# EasyEDA Pro project RGB_light_master.epro

# Schematic Schematic1
Board Name: Board1; Create Date: 2025-02-03
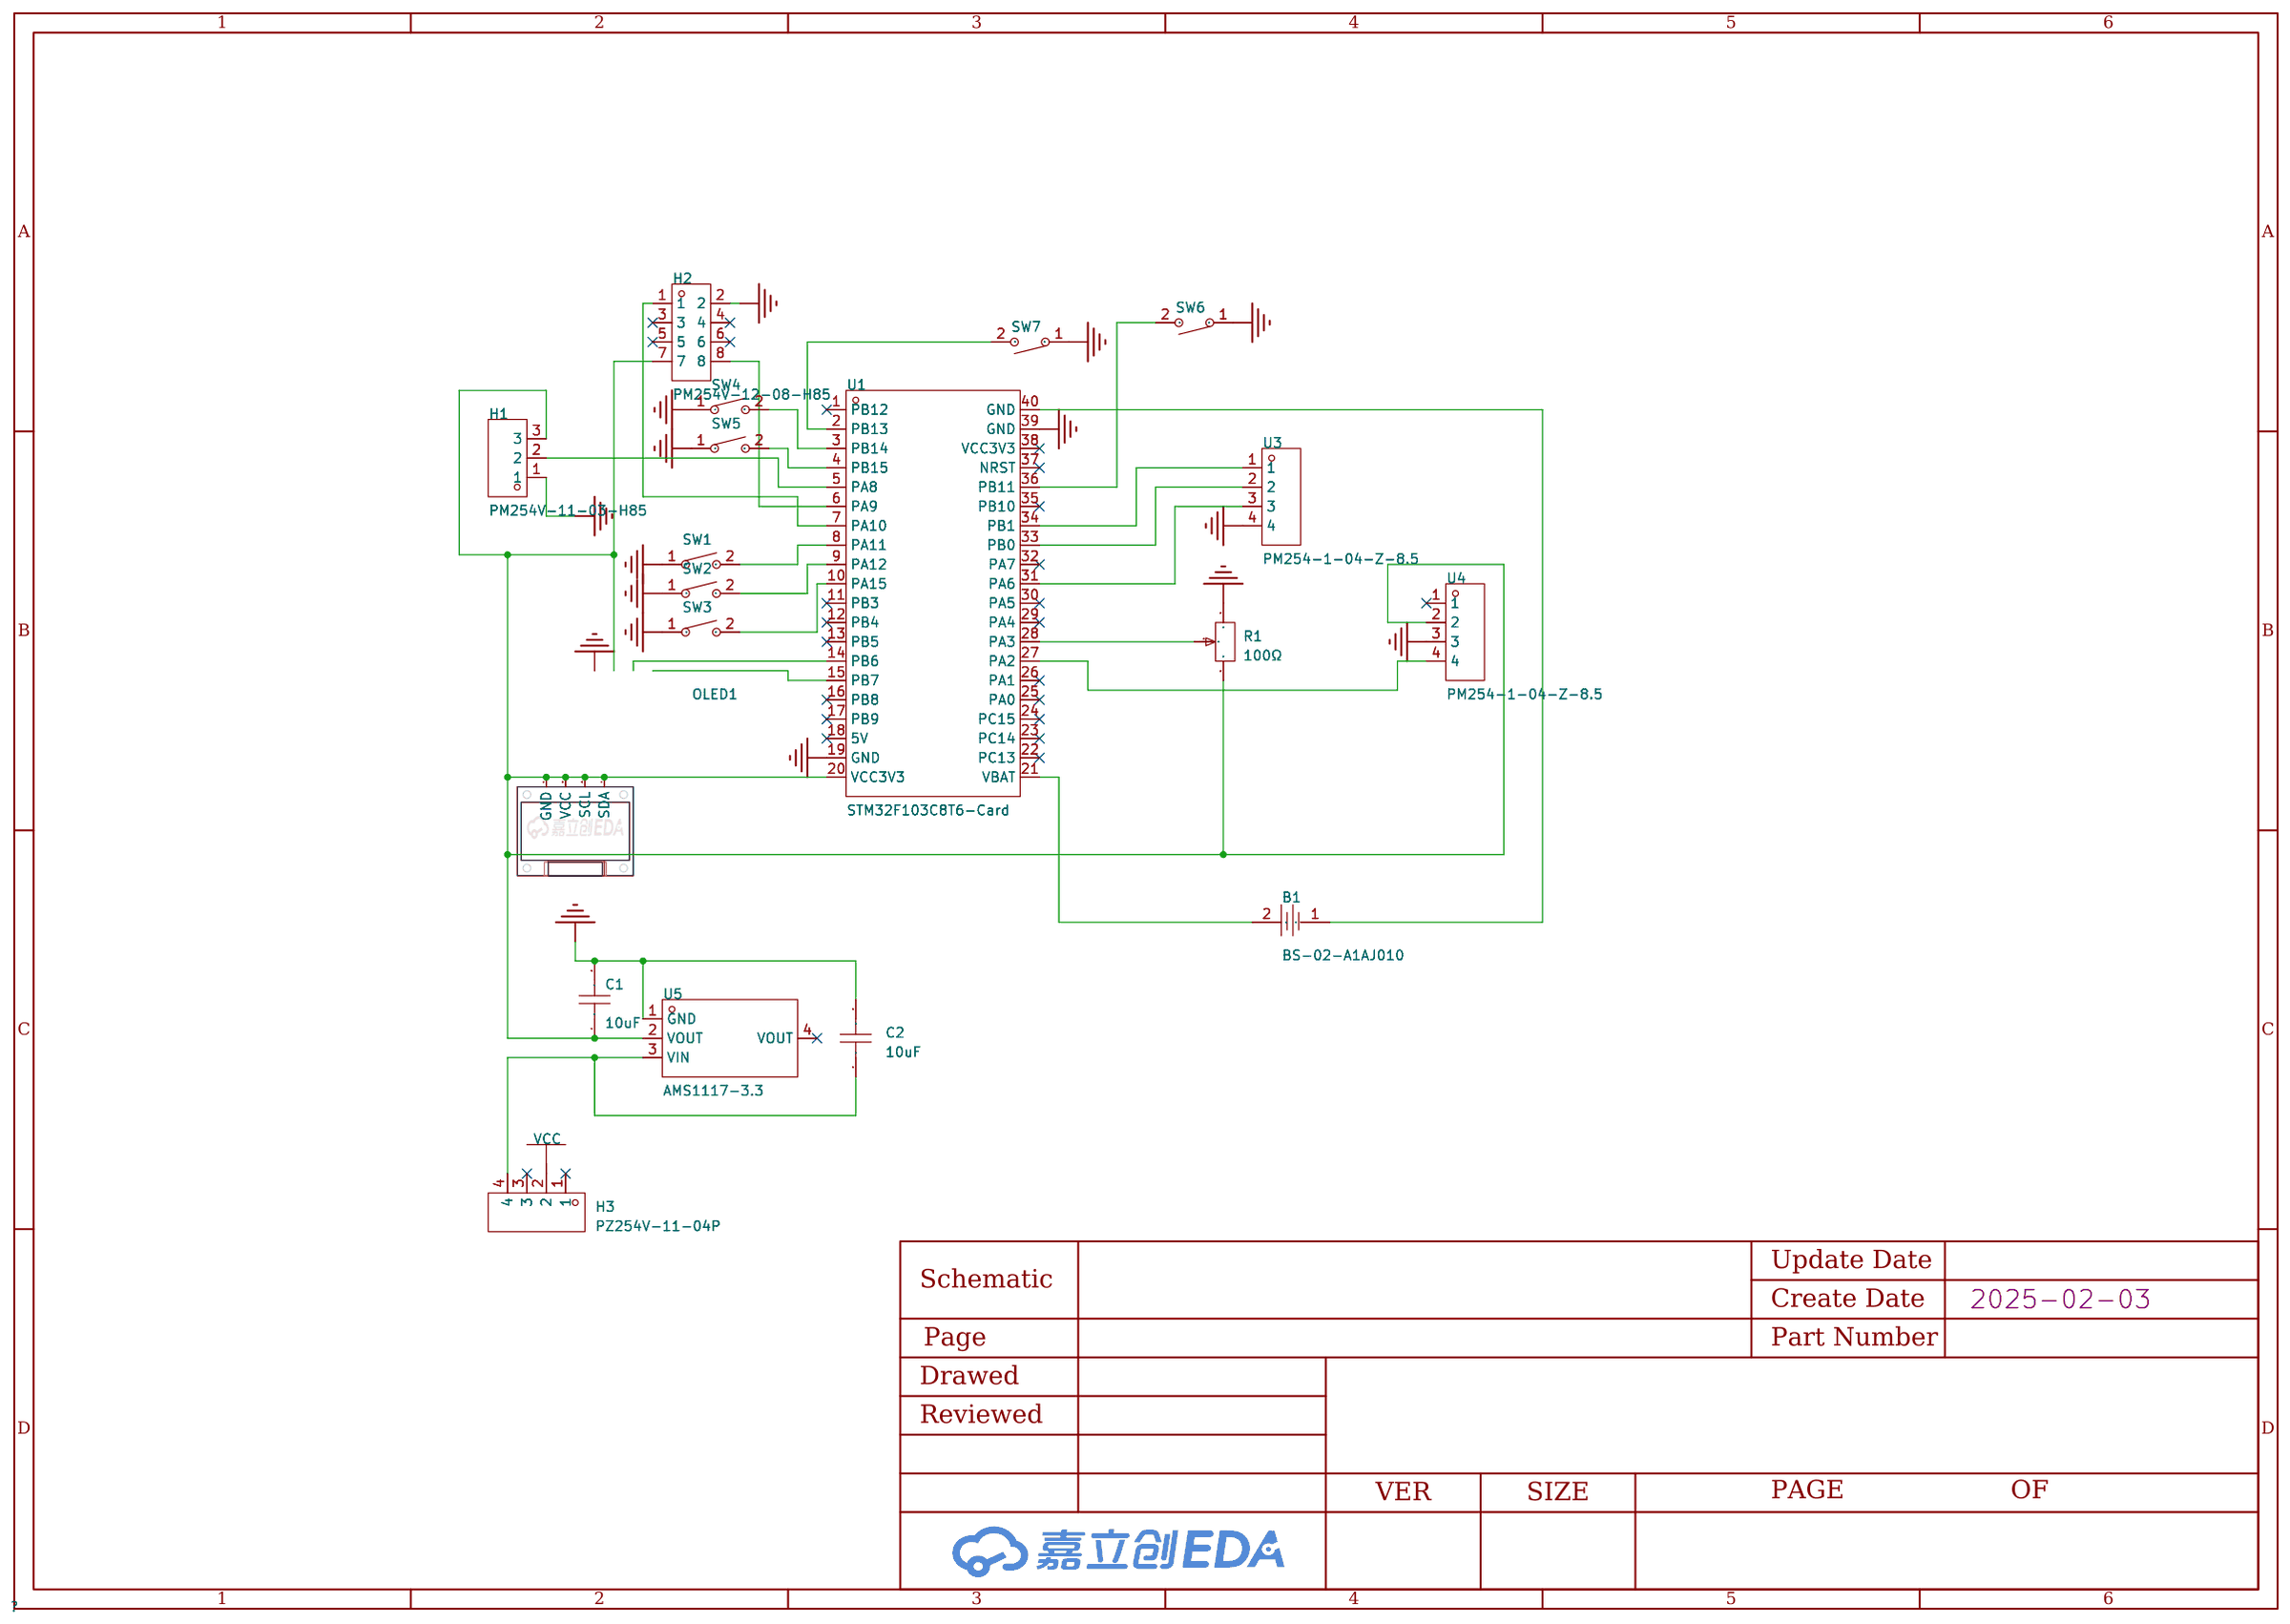
[diagram p0: schematic sheet]

## Parts
B1  BS-02-A1AJ010  [BAT-TH_BS-02-A1AJ010]
C1  10uF  [C0805]
C2  10uF  [C0805]
H1  PM254V-11-03-H85  [HDR-TH_3P-P2.54-V-F]
H2  PM254V-12-08-H85  [HDR-TH_8P-P2.54-V-F-R2-C4-S2.54]
H3  PZ254V-11-04P  [HDR-TH_4P-P2.54-V-M]
OLED1  -  [0.96OLED_4P]
R1  100Ω  [RES-ADJ-TH_3296W]
SW1  TC-1101T-C-B-B  [KEY-TH_2P-L6.0-W3.5-P6.50]
SW2  TC-1101T-C-B-B  [KEY-TH_2P-L6.0-W3.5-P6.50]
SW3  TC-1101T-C-B-B  [KEY-TH_2P-L6.0-W3.5-P6.50]
SW4  TC-1101T-C-B-B  [KEY-TH_2P-L6.0-W3.5-P6.50]
SW5  TC-1101T-C-B-B  [KEY-TH_2P-L6.0-W3.5-P6.50]
SW6  TC-1101T-C-B-B  [KEY-TH_2P-L6.0-W3.5-P6.50]
SW7  TC-1101T-C-B-B  [KEY-TH_2P-L6.0-W3.5-P6.50]
U1  STM32F103C8T6-Card  [CONN-TH_L53.3-W22.9_STM32F103C8T6-CARD]
U3  PM254-1-04-Z-8.5  [hdr-th_4p-p2.54-v-f]
U4  PM254-1-04-Z-8.5  [hdr-th_4p-p2.54-v-f]
U5  AMS1117-3.3  [SOT-223-3_L6.5-W3.4-P2.30-LS7.0-BR]

## Library data of the parts
B1 = BS-02-A1AJ010: 连接器类型:电池底座;适用电池规格:CR2032;触头材质:磷青铜;触点电镀:镍;工作温度范围:-25℃~+85℃;; LCSC Part Name: 电池底座 适用电池:CR2032; Supplier Part: C5239862; Manufacturer: MYOUNG(美阳); Supplier Footprint: 插件; JLCPCB Part Class: 扩展库; Datasheet: https://atta.szlcsc.com/upload/public/pdf/source/20221102/8F00F2B23A2A3C447A59C327BBA6C743.pdf; Supplier: LCSC; Connector Type: 电池底座; Battery Type: CR2032; Contact Material: 磷青铜; Contact Plating: 镍; Operating Temperature Range: -25℃~+85℃
C1 C2 = TMK212BBJ106KGHT: 容值:10uF;精度:±10%;额定电压:25V;材质(温度系数):X5R;; LCSC Part Name: 10uF ±10% 25V; Supplier Part: C386084; Manufacturer: TAIYO YUDEN(太诱); Supplier Footprint: 0805; JLCPCB Part Class: Extended Part; Datasheet: https://atta.szlcsc.com/upload/public/pdf/source/20190827/C386084_49734F228C11E6784046689EB1EEAB2A.pdf; Supplier: LCSC; Tolerance: ±10%; Voltage Rated: 25V; Temperature Coefficient: X5R
H1 = PM254V-11-03-H85: 插孔结构:1x3P;间距:2.54mm;行距:-;安装类型:直插;排数:单排;总孔位数:3P;塑高:-;触头材质:黄铜;触头镀层:-;; LCSC Part Name: 间距:2.54mm 1x3P 直插; Supplier Part: C541850; Manufacturer: XFCN(兴飞); Supplier Footprint: 插件,P=2.54mm; JLCPCB Part Class: 扩展库; Datasheet: https://atta.szlcsc.com/upload/public/pdf/source/20200518/C541849_85853D71FC67C51915A806977A588FDA.pdf; Supplier: LCSC; Holes Structure: 1x3P; Pitch: 2.54mm; Mounting Type: 直插; Number of Rows: 单排; Number of Holes: 3P; Contact Material: 黄铜
H2 = PM254V-12-08-H85: 插孔结构:2x4P;间距:2.54mm;行距:2.54mm;圆孔/方孔:方孔;安装类型:直插;排数:双排;总孔位数:8P;额定电流:3A;额定电压:250V;插孔方向:顶部;塑高:8.5mm;工作温度范围:-40℃~+105℃;; LCSC Part Name: 间距:2.54mm 2x4P 直插; Supplier Part: C2834799; Manufacturer: XFCN(兴飞); Supplier Footprint: 插件,P=2.54mm; JLCPCB Part Class: 扩展库; Datasheet: https://atta.szlcsc.com/upload/public/pdf/source/20200309/C492399_8C441E2934FBB604A89B37A68AA45ECF.pdf; Supplier: LCSC; Holes Structure: 2x4P; Pitch: 2.54mm; Row Spacing: 2.54mm; Circular Hole / Square Hole: 方孔; Mounting Type: 直插; Number of Rows: 双排; Number of Holes: 8P; Current Rating (Max): 3A; Voltage Rating (Max): 250V; Holes Direction: 顶部; Insulation Height: 8.5mm; Operating Temperature Range: -40℃~+105℃
H3 = PZ254V-11-04P: 插针结构:1x4P;间距:2.54mm;行距:-;圆针/方针:方针;安装类型:直插;排数:单排;总PIN位数:4P;额定电流:3A;额定电压:250V;配合针长度:6mm;塑高:2.5mm;端接针长度:3mm;触头材质:-;工作温度范围:-40℃~+105℃;颜色:黑色;; LCSC Part Name: 间距:2.54mm 1x4P 直插 方针; Supplier Part: C2691448; Manufacturer: XFCN(兴飞); Supplier Footprint: 插件,P=2.54mm; JLCPCB Part Class: 扩展库; Datasheet: https://atta.szlcsc.com/upload/public/pdf/source/20200309/C492403_F9F19131791D08044AD4F84F8E751A34.pdf; Supplier: LCSC; Pin Structure: 1x4P; Pitch: 2.54mm; Circluar Pins/Square Pins: 方针; Mounting Type: 直插; Number of Rows: 单排; Number of Pins: 4P; Current Rating (Max): 3A; Voltage Rating (Max): 250V; Length of Mating Pin: 6mm; Insulation Height: 2.5mm; Length of End Connection Pin: 3mm; Operating Temperature Range: -40℃~+105℃; Color: 黑色
OLED1 = 0.96OLED模块_4P: Supplier Footprint: 插件
R1 = 3296W-1-101LF: 阻值:100Ω;精度:±10%;; LCSC Part Name: 100Ω ±10%; Supplier Part: C83688; Manufacturer: BOURNS; Supplier Footprint: SIP-3P,9.5x4.8mm; JLCPCB Part Class: 扩展库; Datasheet: https://atta.szlcsc.com/upload/public/pdf/source/20180326/C111793_7BE3639881F18EA7BF3D269EDA80A489.pdf; Supplier: LCSC; Tolerance: ±10%
SW1-SW7 = TC-1101T-C-B-B: 电路结构:单刀单掷;按钮形状:矩形按钮;作用力:260gf;安装方式:直插;开关长度:6mm;开关宽度:3.5mm;开关高度:5mm;带支架:不带;触点电流:50mA;额定电压(DC):12V;绝缘电阻:-;带灯:无;机械寿命:5万次;; LCSC Part Name: 6*3.5*5mm 直插 轻触开关; Supplier Part: C500068; Manufacturer: XKB Connectivity(中国星坤); Supplier Footprint: 插件; JLCPCB Part Class: 扩展库; Datasheet: https://atta.szlcsc.com/upload/public/pdf/source/20211011/B69A8CD93B4DADD1FF98516D35420DE2.pdf; Supplier: LCSC; Circuit: 单刀单掷; Actuator Style: 矩形按钮; Operating Force: 260gf; Mounting Style: 直插; Switch Length: 6mm; Switch Width: 3.5mm; Switch Height: 5mm; Strike Gundam: 不带; Contact Current: 50mA; Voltage Rating (DC): 12V; Actuator/Cap Color: 黑色; With Lamp: 无; Pin Style: PC引脚; Mechanical Life: 5万次; Operating Temperature: -20℃~+70℃
U1 = STM32F103C8T6-Card: Supplier Part: C9900077949; Supplier Footprint: 插件; JLCPCB Part Class: Extended Part; Supplier: LCSC
U3 U4 = PM254-1-04-Z-8.5_C2897367: 插孔结构:1x4P;间距:2.54mm;行距:-;圆孔/方孔:方孔;安装类型:直插;排数:单排;总孔位数:4P;额定电流:3A;额定电压:-;插孔方向:顶部;塑高:8.5mm;触头材质:铜合金;工作温度范围:-40℃~+105℃;焊接温度(最大值):260℃@5S;; LCSC Part Name: 1x4P 间距:2.54mm 直插; Supplier Part: C2897367; Manufacturer: HCTL(华灿天禄); Supplier Footprint: 插件,P=2.54mm; JLCPCB Part Class: 扩展库; Datasheet: https://atta.szlcsc.com/upload/public/pdf/source/20230609/534BE42964C679BDE98E061007C4ABD6.pdf; Supplier: LCSC; Holes Structure: 1x4P; Pitch: 2.54mm; Circular Hole / Square Hole: 方孔; Mounting Type: 直插; Number of Rows: 单排; Number of Holes: 4P; Current Rating (Max): 3A; Holes Direction: 顶部; Insulation Height: 8.5mm; Contact Material: 铜合金; Operating Temperature Range: -40℃~+105℃; Soldering Temperature(Max): 260℃@5S
U5 = AMS1117-3.3_C6186: 输出类型:固定;最大输入电压:-;输出电压:3.3V;最大输出电流:1A;电源纹波抑制比(PSRR):72dB@(120Hz);输出极性:正极;; LCSC Part Name: 输出3.3V 1A; Supplier Part: C6186; Manufacturer: AMS; Supplier Footprint: SOT-223; JLCPCB Part Class: 基础库; Datasheet: https://atta.szlcsc.com/upload/public/pdf/source/20180727/C6186_7A095716F0823C02F1997A905E26C086.pdf; Supplier: LCSC; Output Type: 固定; Output Voltage: 3.3V; MAX Output Current: 1A; Power Supply Rejection Ratio (PSRR): 72dB@(120Hz); Dropout Voltage: 1.3V@(800mA); Output Polarity: 正极; Number of Outputs: 1

## Nets
GND: C1.2 C2.2 H1.1 H2.2 R1.1 SW1.1 SW2.1 SW3.1 SW4.1 SW5.1 SW6.1 SW7.1 U1.19(GND) U1.39(GND) U3.4 U4.3 U5.1(GND)
VCC: H3.2
$1N1795: H1.2 U1.5(PA8)
$1N1867: B1.2 U1.21(VBAT)
$1N2447: U1.34(PB1) U3.1
$1N2475: U1.33(PB0) U3.2
$1N2481: U1.31(PA6) U3.3
$1N2668: R1.2 U1.28(PA3)
$1N2708: U1.27(PA2) U4.4
$1N2957: H2.1 U1.7(PA10)
$1N3555: H2.8 U1.6(PA9)
Net-(B1-1): B1.1 U1.40(GND)
Net-(C1-1): C1.1 H1.3 H2.7 OLED1.1(GND) OLED1.2(VCC) OLED1.3(SCL) OLED1.4(SDA) R1.3 U1.20(VCC3V3) U4.2 U5.2(VOUT)
Net-(C2-1): C2.1 H3.4 U5.3(VIN)
Net-(SW1-2): SW1.2 U1.8(PA11)
Net-(SW2-2): SW2.2 U1.9(PA12)
Net-(SW3-2): SW3.2 U1.10(PA15)
Net-(SW4-2): SW4.2 U1.3(PB14)
Net-(SW5-2): SW5.2 U1.4(PB15)
Net-(SW6-2): SW6.2 U1.36(PB11)
Net-(SW7-2): SW7.2 U1.2(PB13)

Not connected (* = marked no-connect by the designer): H2 3* 4* 5* 6*; H3 1* 3*; U1 1(PB12)* 11(PB3)* 12(PB4)* 13(PB5)* 14(PB6) 15(PB7) 16(PB8)* 17(PB9)* 18(5V)* 22(PC13)* 23(PC14)* 24(PC15)* 25(PA0)* 26(PA1)* 29(PA4)* 30(PA5)* 32(PA7)* 35(PB10)* 37(NRST)* 38(VCC3V3)*; U4 1*; U5 4(VOUT)*

# Board PCB1
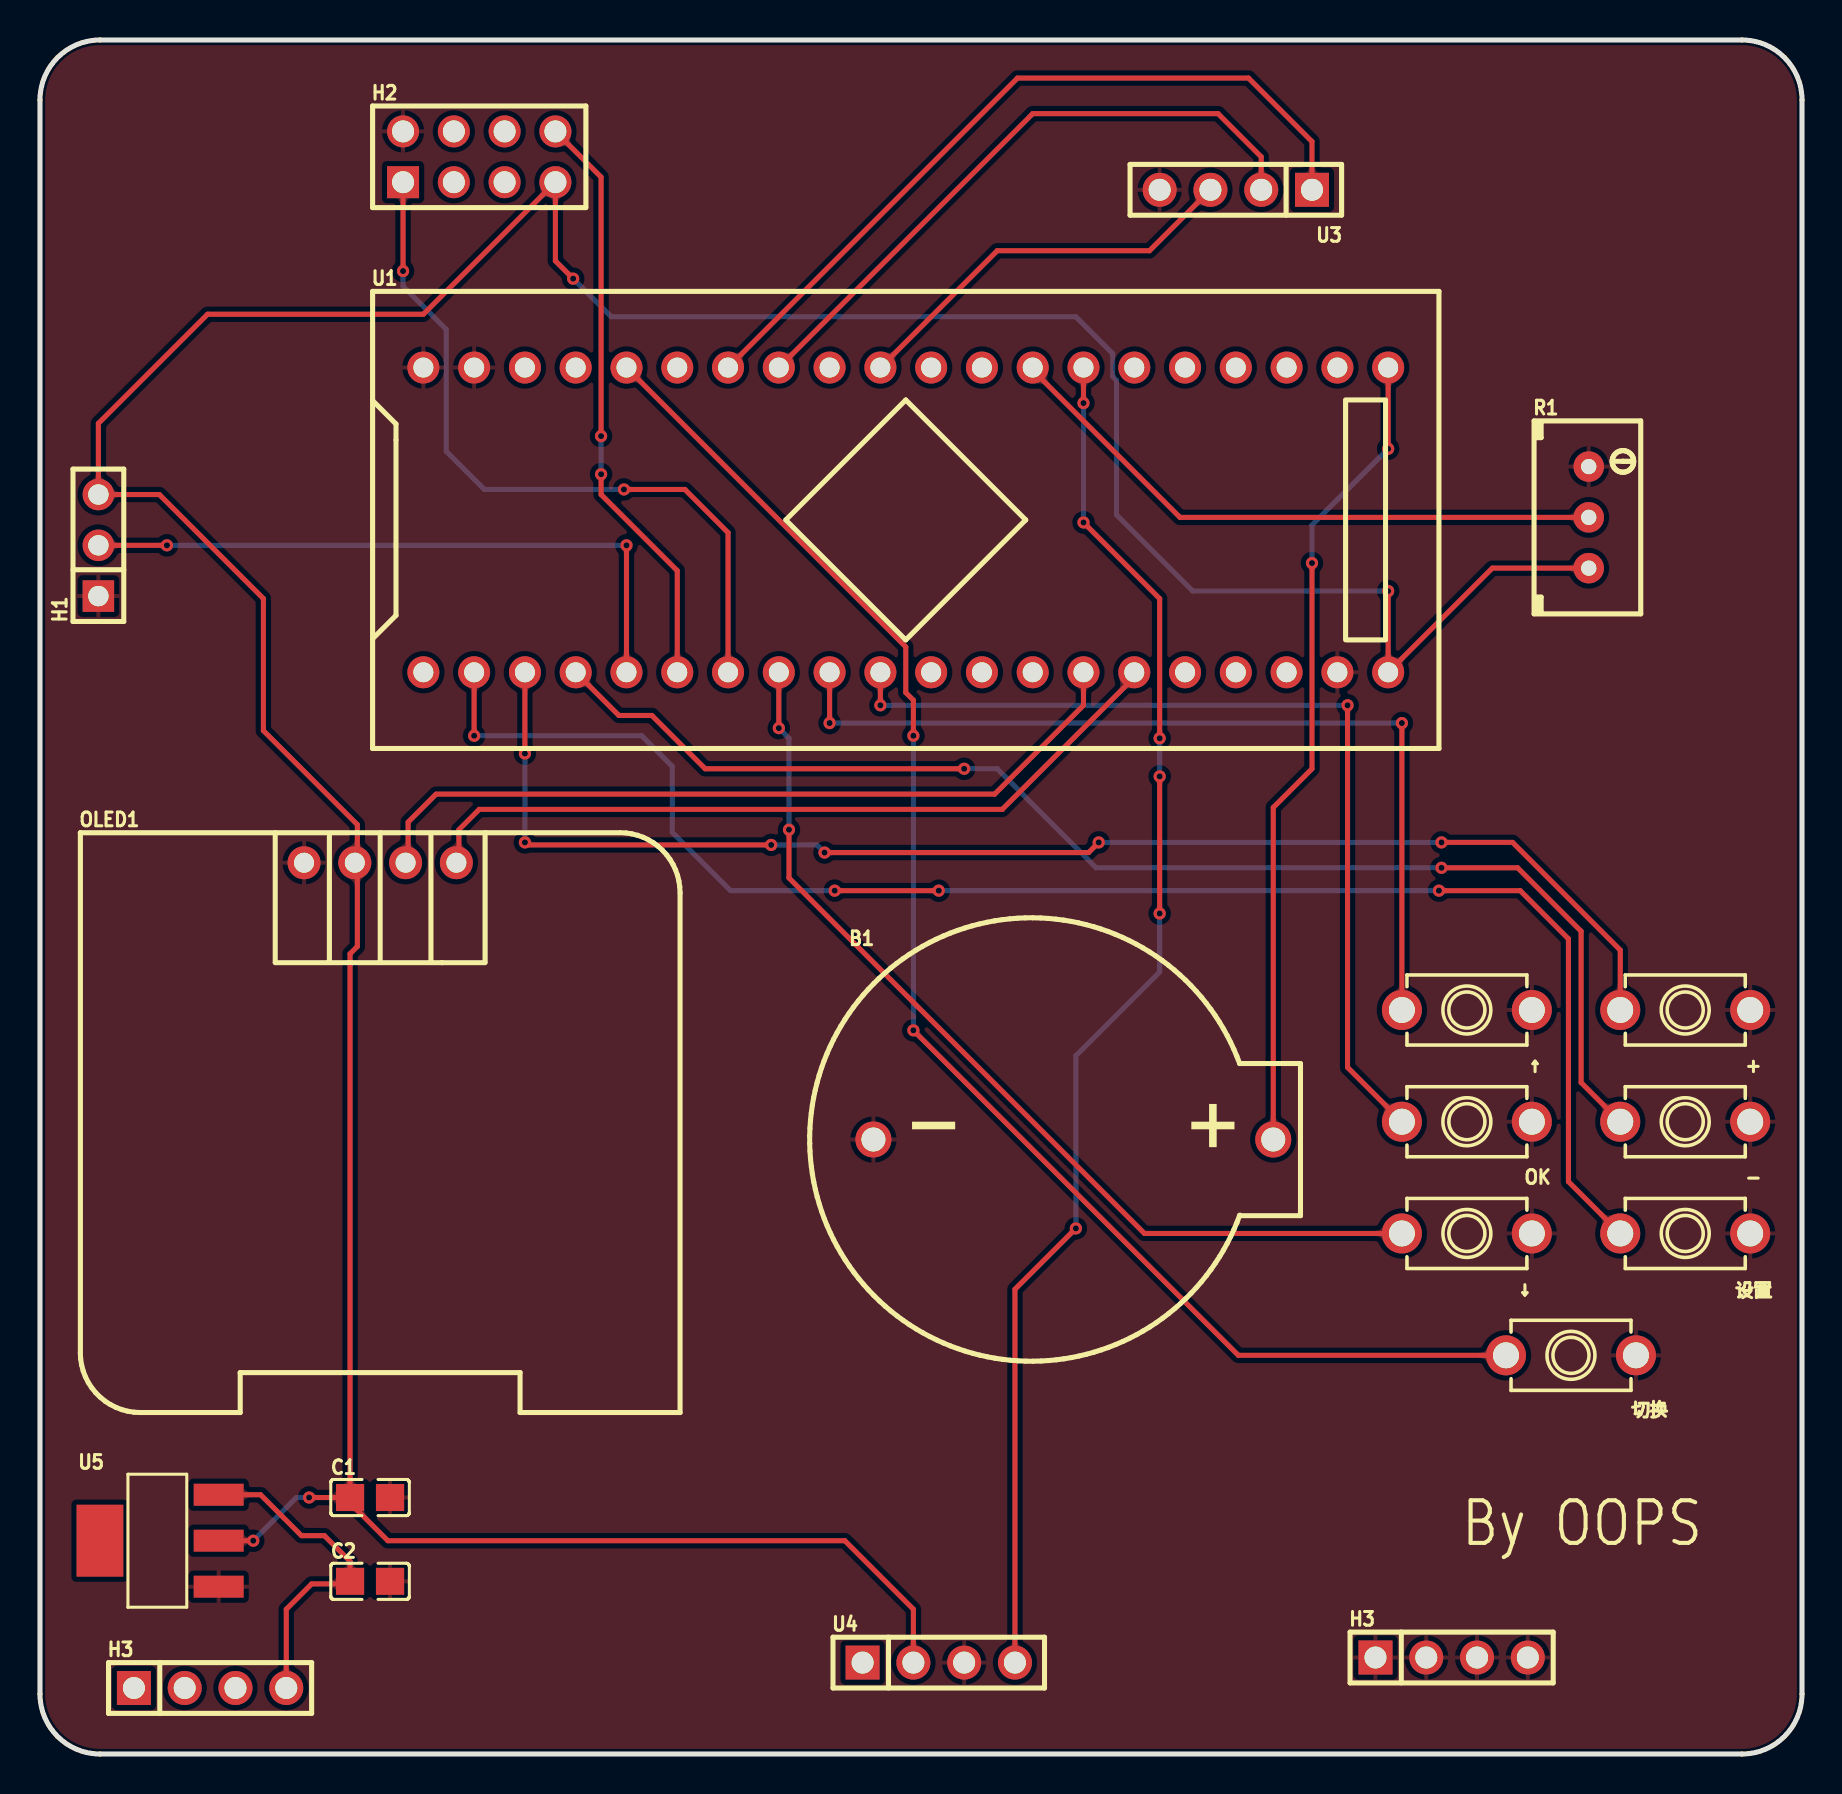
[diagram p1: board, top side]
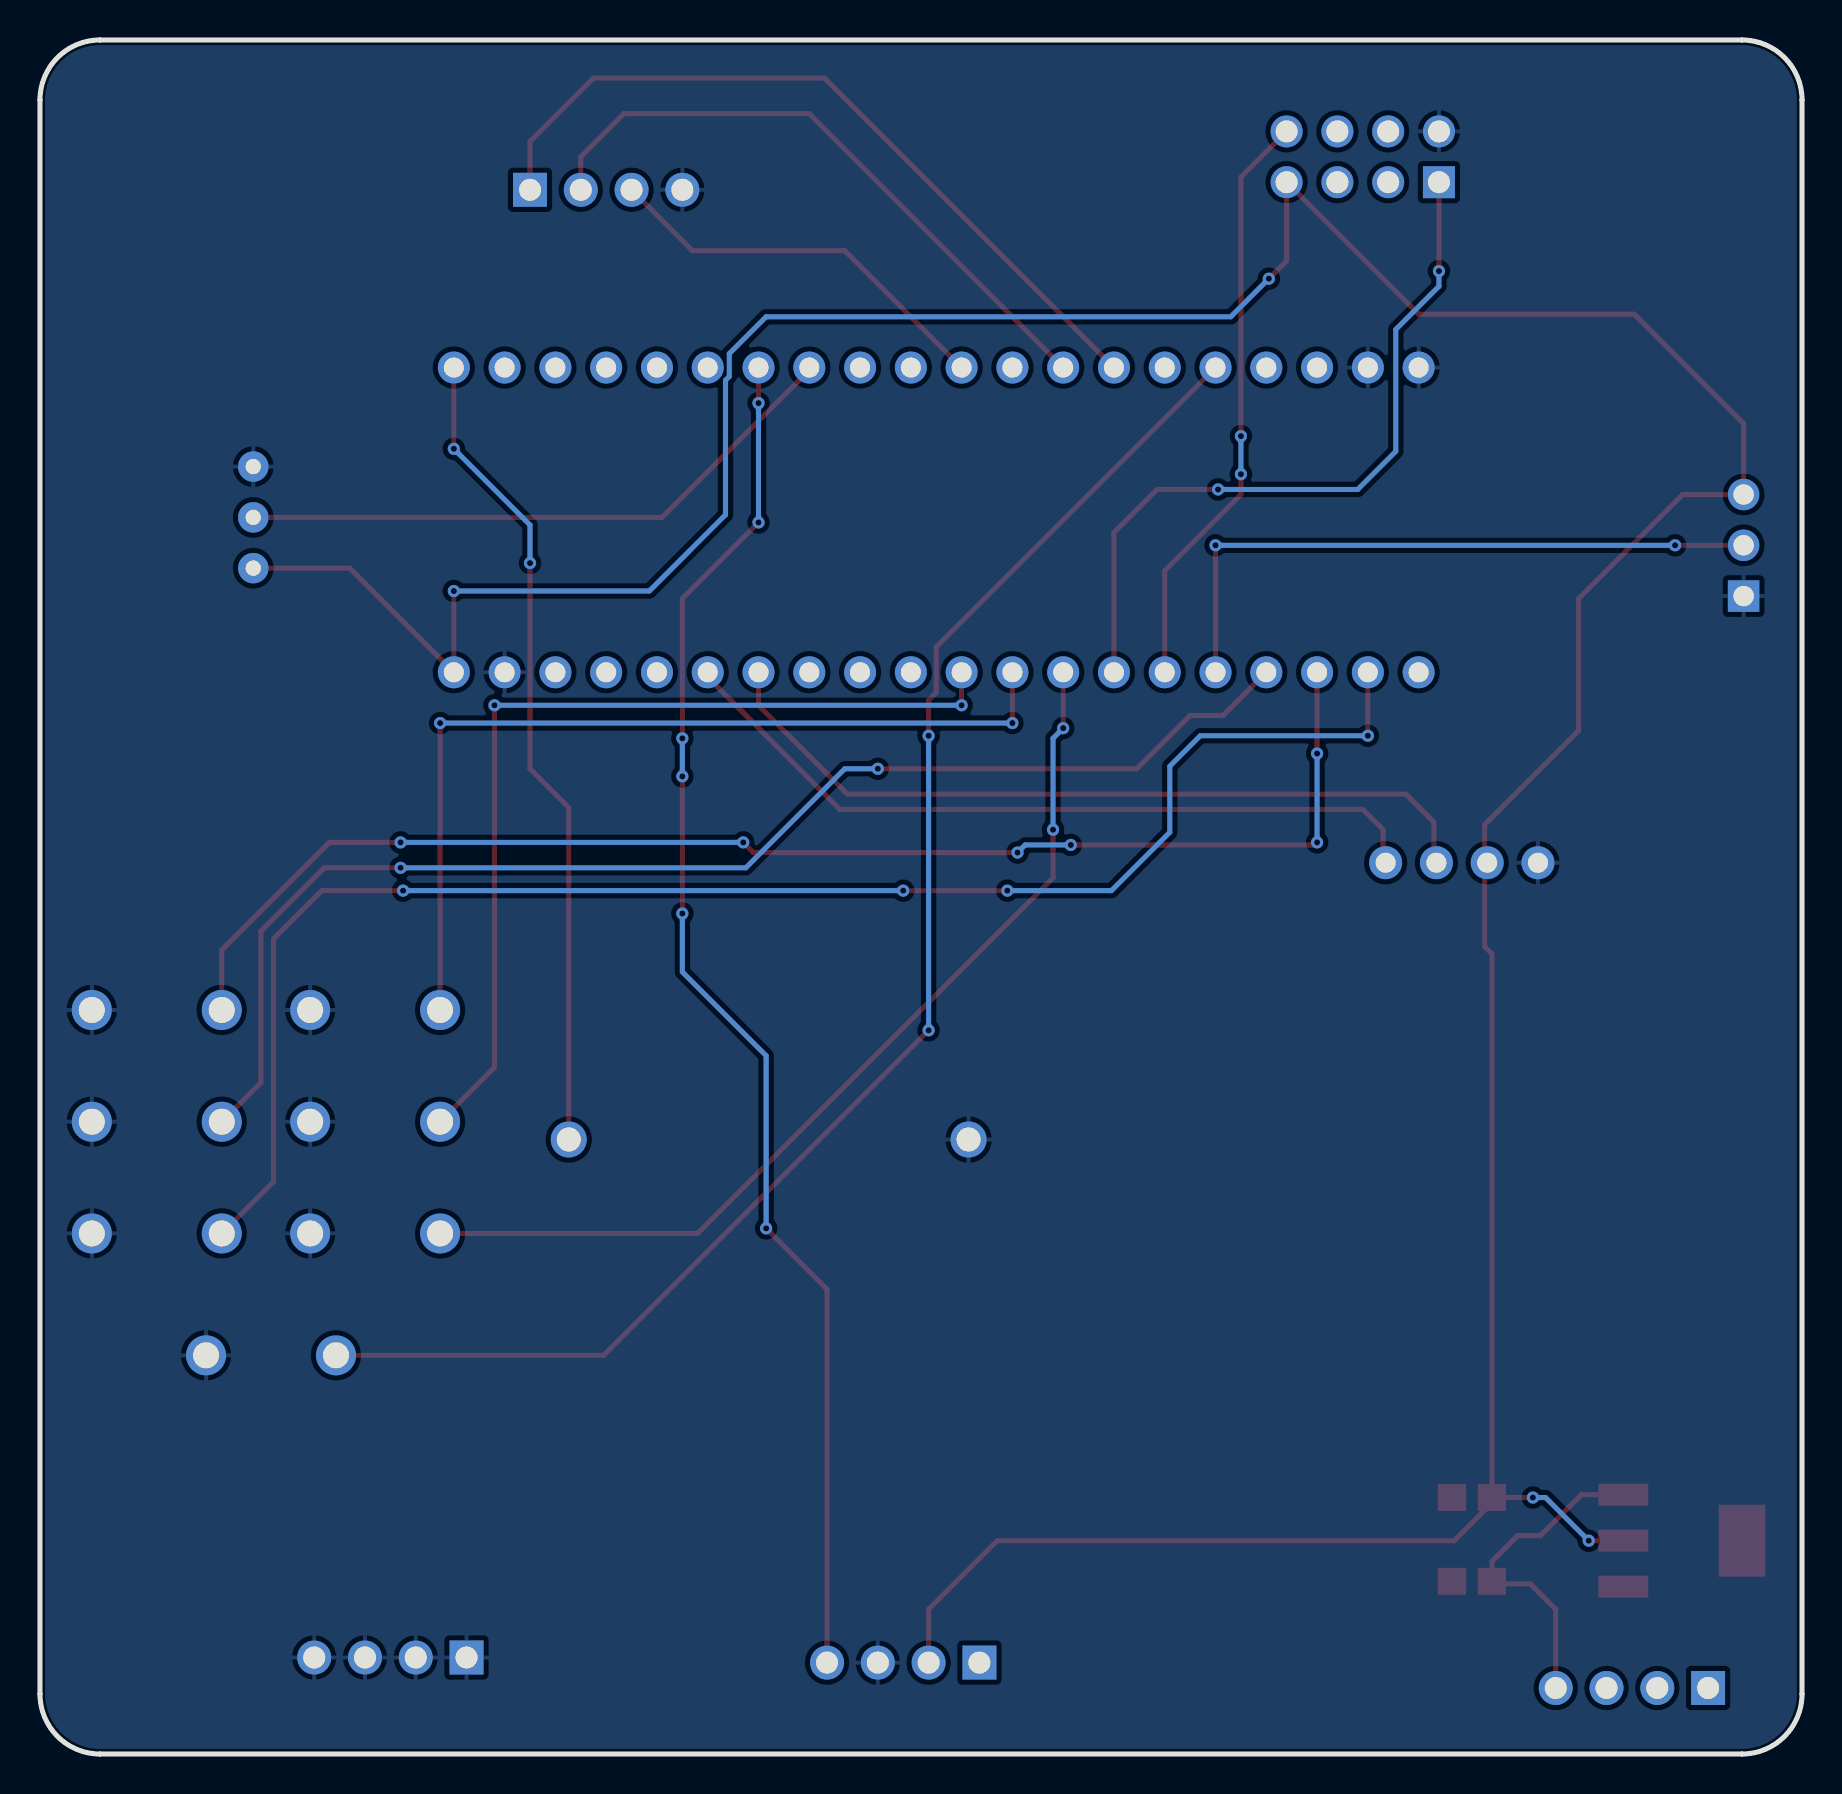
[diagram p2: board, bottom side, seen from below]

Outline 88.14 x 85.72 mm; copper layers: Top Layer, Bottom Layer. Coordinates in mm from the lower left corner of the outline.
Outline path: 0,82.72 0,3 arc(0.88,0.88) 3,0 85.14,0 arc(87.26,0.88) 88.14,3 88.14,82.72 arc(87.26,84.85) 85.14,85.72 3,85.72 arc(0.88,84.85) 0,82.72
Stack: Top Layer 0.035mm / Dielectric1 1.51mm FR4 er 4.5 / Bottom Layer 0.035mm

## Design rules (mm)
template: JLCPCB Capability(Two Layers Board)
spacing copperThickness1oz (default): track to track 0.102, other pairs 0.152 to 0.3
spacing copperThickness2oz: track to track 0.203, other pairs 0.152 to 0.3
track width copperThickness1oz (default): min 0.127, default 0.254, max 2.54
track width copperThickness2oz: min 0.203, default 0.254, max 2.54
differential pair differentialPair (default): width min 0.127, default 0.254, max 2.54; gap min 0.152, default 0.152
via viaSize (default): diameter min 0.5, default 0.61, max 10; hole min 0.3, default 0.305, max 6.3

## Placement (name value [footprint] x y rotation side)
+  TC-1101T-C-B-B  [KEY-TH_2P-L6.0-W3.5-P6.50]  82.3 37.21 180 top
-  TC-1101T-C-B-B  [KEY-TH_2P-L6.0-W3.5-P6.50]  82.3 31.62 180 top
B1  BS-02-A1AJ010  [BAT-TH_BS-02-A1AJ010]  51.69 30.73 0 top
C1  10uF  [C0805]  16.51 12.83 0 top
C2  10uF  [C0805]  16.51 8.64 0 top
H1  PM254V-11-03-H85  [HDR-TH_3P-P2.54-V-F]  2.92 60.45 90 top
H2  PM254V-12-08-H85  [HDR-TH_8P-P2.54-V-F-R2-C4-S2.54]  21.97 79.88 0 top
H3  PZ254V-11-04P  [HDR-TH_4P-P2.54-V-M]  8.51 3.3 0 top
H3#2  -  [HDR-TH_4P-P2.54-V-M]  70.61 4.83 0 top
OK  TC-1101T-C-B-B  [KEY-TH_2P-L6.0-W3.5-P6.50]  71.37 31.62 180 top
OLED1  -  [0.96OLED_4P]  17.02 44.58 0 top
R1  100Ω  [RES-ADJ-TH_3296W]  77.47 61.85 0 top
U1  STM32F103C8T6-Card  [CONN-TH_L53.3-W22.9_STM32F103C8T6-CARD]  43.31 61.72 0 top
U3  PM254-1-04-Z-8.5  [hdr-th_4p-p2.54-v-f]  59.82 78.23 180 top
U4  PM254-1-04-Z-8.5  [hdr-th_4p-p2.54-v-f]  44.96 4.57 0 top
U5  AMS1117-3.3  [SOT-223-3_L6.5-W3.4-P2.30-LS7.0-BR]  5.97 10.67 0 top
↑  TC-1101T-C-B-B  [KEY-TH_2P-L6.0-W3.5-P6.50]  71.37 37.21 180 top
↓  TC-1101T-C-B-B  [KEY-TH_2P-L6.0-W3.5-P6.50]  71.37 26.04 180 top
切换  TC-1101T-C-B-B  [KEY-TH_2P-L6.0-W3.5-P6.50]  76.58 19.94 180 top
设置  TC-1101T-C-B-B  [KEY-TH_2P-L6.0-W3.5-P6.50]  82.3 26.04 180 top

## Footprints (pads in the part's own frame, mm; a bottom-side part is the same pattern mirrored in y, then rotated)
0.96OLED_4P
  round 1.65 hole 1: 1(-3.81,-0.002) 2(-1.27,0.002) 3(1.27,0.002) 4(3.81,0.002)
BAT-TH_BS-02-A1AJ010
  round 1.8 hole 1.2: 1(-10,0) 2(10,0)
C0805
  rect 1.41x1.35 smd: 1(-1,0) 2(1,0)
CONN-TH_L53.3-W22.9_STM32F103C8T6-CARD
  round 1.6 hole 1: 1(-24.13,-7.62) 2(-21.59,-7.62) 3(-19.05,-7.62) 4(-16.51,-7.62) 5(-13.97,-7.62) 6(-11.43,-7.62) 7(-8.89,-7.62) 8(-6.35,-7.62) 9(-3.81,-7.62) 10(-1.27,-7.62) 11(1.27,-7.62) 12(3.81,-7.62) 13(6.35,-7.62) 14(8.89,-7.62) 15(11.43,-7.62) 16(13.97,-7.62) 17(16.51,-7.62) 18(19.05,-7.62) 19(21.59,-7.62) 20(24.13,-7.62) 21(24.13,7.62) 22(21.59,7.62) 23(19.05,7.62) 24(16.51,7.62) 25(13.97,7.62) 26(11.43,7.62) 27(8.89,7.62) 28(6.35,7.62) 29(3.81,7.62) 30(1.27,7.62) 31(-1.27,7.62) 32(-3.81,7.62) 33(-6.35,7.62) 34(-8.89,7.62) 35(-11.43,7.62) 36(-13.97,7.62) 37(-16.51,7.62) 38(-19.05,7.62) 39(-21.59,7.62) 40(-24.13,7.62)
HDR-TH_3P-P2.54-V-F
  rect 1.575x1.575 hole 1.02: 1(-2.54,0)
  round 1.575 hole 1.02: 2(0,0) 3(2.54,0)
hdr-th_4p-p2.54-v-f
  rect 1.7x1.7 hole 1.1: 1(-3.81,0)
  round 1.7 hole 1.1: 2(-1.27,0) 3(1.27,0) 4(3.81,0)
HDR-TH_4P-P2.54-V-M
  rect 1.7x1.7 hole 1.1: 1(-3.81,0)
  round 1.7 hole 1.1: 2(-1.27,0) 3(1.27,0) 4(3.81,0)
HDR-TH_8P-P2.54-V-F-R2-C4-S2.54
  rect 1.6x1.6 hole 1.1: 1(-3.81,-1.27)
  round 1.6 hole 1.1: 2(-3.81,1.27) 3(-1.27,-1.27) 4(-1.27,1.27) 5(1.27,-1.27) 6(1.27,1.27) 7(3.81,-1.27) 8(3.81,1.27)
KEY-TH_2P-L6.0-W3.5-P6.50
  round 2 hole 1.3: 1(-3.25,0) 2(3.25,0)
RES-ADJ-TH_3296W
  round 1.524 hole 0.762: 1(0,2.54) 2(0,0) 3(0,-2.54)
SOT-223-3_L6.5-W3.4-P2.30-LS7.0-BR
  rect 2.5x1.1 smd: 1(2.97,-2.3) 2(2.97,0) 3(2.97,2.3)
  rect 2.34x3.6 smd: 4(-2.97,0)

## Nets
GND: +.1 -.1 B1.1 C1.2 C2.2 H1.1 H2.2 H3#2.1 H3#2.2 H3#2.3 H3#2.4 OK.1 OLED1.1 R1.1 U1.19 U1.39 U1.40 U3.4 U4.3 U5.1 ↑.1 ↓.1 切换.1 设置.1
VCC: H3.2
$1N1619: C2.1 H3.4 U5.3
$1N1652: OLED1.3 U1.14
$1N1658: OLED1.4 U1.15
$1N1795: H1.2 U1.5
$1N1867: B1.2 U1.21
$1N2447: U1.34 U3.1
$1N2475: U1.33 U3.2
$1N2481: U1.31 U3.3
$1N2668: R1.2 U1.28
$1N2673: C1.1 H1.3 H2.7 OLED1.2 R1.3 U1.20 U4.2 U5.2
$1N2708: U1.27 U4.4
$1N2957: H2.1 U1.7
$1N3039: U1.8 ↓.2
$1N3171: U1.9 ↑.2
$1N3177: OK.2 U1.10
$1N3436: U1.36 切换.2
$1N3466: +.2 U1.3
$1N3475: -.2 U1.4
$1N3490: U1.2 设置.2
$1N3555: H2.8 U1.6

Pads without a net: H2 3 4 5 6; H3 1 3; U1 1 11 12 13 16 17 18 22 23 24 25 26 29 30 32 35 37 38; U4 1; U5 4

## Via types
v1: diameter 0.61, hole 0.305, Top Layer to Bottom Layer, 38 vias

## Routing (per net, layer and track width the routed paths; a pad name or vN(x,y) marks a point on that pad's centre or on a via; arc(x,y) is an arc through that point)
$1N1619: length 16.7
  Top Layer w0.254: U5.3 11.03,12.97 13.08,10.92 14.22,10.92 15.51,9.64 C2.1 15.38,8.51 13.59,8.51 12.32,7.24 H3.4
$1N1652: length 39.9
  Top Layer w0.254: 18.42,44.58 18.42,46.61 19.81,48.01 47.75,48.01 52.2,52.45 U1.14
$1N1658: length 38.8
  Top Layer w0.254: 20.95,44.58 20.95,46.23 21.97,47.24 48.13,47.24 54.74,53.85 U1.15
$1N1795: length 32.8
  Top Layer w0.254: H1.2 v1(6.35,60.45) ; v1(29.34,60.45) U1.5
  Bottom Layer w0.254: v1(6.35,60.45) v1(29.34,60.45)
$1N1867: length 41
  Top Layer w0.254: B1.2 61.69,47.34 63.63,49.28 v1(63.63,59.56) ; v1(67.44,65.28) U1.21
  Bottom Layer w0.254: v1(63.63,59.56) 63.63,61.47 v1(67.44,65.28)
$1N2447: length 38.9
  Top Layer w0.254: U1.34 48.9,83.82 60.45,83.82 63.63,80.65 U3.1
$1N2475: length 31.9
  Top Layer w0.254: U1.33 49.66,82.04 58.93,82.04 61.09,79.88 U3.2
$1N2481: length 20.2
  Top Layer w0.254: U1.31 47.88,75.18 55.5,75.18 U3.3
$1N2668: length 31
  Top Layer w0.254: R1.2 57.02,61.85 49.66,69.22 U1.28
$1N2673: length 203
  Top Layer w0.254: U5.2 v1(10.67,10.67) ; v1(13.46,12.83) C1.1 ; C1.1 15.51,40.02 15.88,40.39 15.88,46.48 11.18,51.18 11.18,57.79 5.97,62.99 H1.3 2.92,66.55 8.38,72.01 19.18,72.01 25.78,78.61 25.78,74.68 v1(26.67,73.79) ; C1.1 15.51,12.56 17.4,10.67 40.26,10.67 43.69,7.24 U4.2 ; v1(67.44,58.17) U1.20 72.64,59.31 R1.3
  Bottom Layer w0.254: v1(26.67,73.79) 28.57,71.88 51.82,71.88 53.66,70.04 53.66,68.9 53.85,68.7 53.85,61.98 57.66,58.17 v1(67.44,58.17) ; v1(10.67,10.67) 12.83,12.83 v1(13.46,12.83)
$1N2708: length 69.3
  Top Layer w0.254: v1(56.01,50.8) 56.01,57.79 v1(52.2,61.59) ; v1(56.01,42.04) v1(56.01,48.9) ; v1(51.82,26.29) 48.77,23.24 U4.4 ; v1(52.2,67.56) U1.27
  Bottom Layer w0.254: v1(51.82,26.29) 51.82,34.92 56.01,39.12 v1(56.01,42.04) ; v1(56.01,48.9) v1(56.01,50.8) ; v1(52.2,61.59) v1(52.2,67.56)
$1N2957: length 37.1
  Top Layer w0.254: U1.7 34.42,61.09 32.26,63.25 v1(29.21,63.25) ; 18.16,78.61 v1(18.16,74.17)
  Bottom Layer w0.254: v1(29.21,63.25) 22.22,63.25 20.32,65.15 20.32,71.25 18.16,73.41 v1(18.16,74.17)
$1N3039: length 48.5
  Top Layer w0.254: v1(36.96,51.31) U1.8 ; ↓.2 55.25,26.04 37.47,43.81 v1(37.47,46.23)
  Bottom Layer w0.254: v1(36.96,51.31) 37.47,50.8 v1(37.47,46.23)
$1N3171: length 45.5
  Top Layer w0.254: ↑.2 v1(68.12,51.56) ; v1(39.5,51.56) U1.9
  Bottom Layer w0.254: v1(68.12,51.56) v1(39.5,51.56)
$1N3177: length 47
  Top Layer w0.254: v1(42.04,52.45) U1.10 ; OK.2 65.41,34.34 v1(65.41,52.45)
  Bottom Layer w0.254: v1(65.41,52.45) v1(42.04,52.45)
$1N3436: length 75.5
  Top Layer w0.254: U1.36 43.31,55.37 43.31,53.09 43.69,52.7 v1(43.69,50.93) ; v1(43.69,36.2) 59.94,19.94 切换.2
  Bottom Layer w0.254: v1(43.69,36.2) v1(43.69,50.93)
$1N3466: length 68.9
  Top Layer w0.254: v1(39.24,45.09) 52.45,45.09 v1(52.96,45.59) ; v1(36.58,45.47) 24.38,45.47 v1(24.26,45.59) ; v1(70.1,45.59) 73.66,45.59 79.05,40.21 +.2 ; v1(24.26,50.04) U1.3
  Bottom Layer w0.254: v1(36.58,45.47) 38.86,45.47 v1(39.24,45.09) ; v1(70.1,45.59) v1(52.96,45.59) ; v1(24.26,45.59) v1(24.26,50.04)
$1N3475: length 66
  Top Layer w0.254: v1(46.23,49.28) 33.27,49.28 30.61,51.94 28.96,51.94 U1.4 ; v1(70.1,44.32) 73.91,44.32 77.09,41.15 77.09,33.58 -.2
  Bottom Layer w0.254: v1(70.1,44.32) 52.83,44.32 47.88,49.28 v1(46.23,49.28)
$1N3490: length 79.9
  Top Layer w0.254: v1(44.96,43.18) v1(39.75,43.18) ; v1(21.72,50.93) U1.2 ; v1(69.98,43.18) 74.04,43.18 76.45,40.77 76.45,28.63 设置.2
  Bottom Layer w0.254: v1(69.98,43.18) v1(44.96,43.18) ; v1(39.75,43.18) 34.54,43.18 31.62,46.1 31.62,49.4 30.1,50.93 v1(21.72,50.93)
$1N3555: length 29.6
  Top Layer w0.254: v1(28.07,64.01) 28.07,62.99 31.88,59.18 U1.6 ; H2.8 28.07,78.87 v1(28.07,65.91)
  Bottom Layer w0.254: v1(28.07,65.91) v1(28.07,64.01)

## Copper pours and planes (outline as drawn; the poured copper is in the pictures)
GND on Top Layer: -4.32,89.53 93.73,89.53 93.73,-8 -4.32,-8
GND on Bottom Layer: -10.8,94.23 103,94.23 103,-10.41 -10.8,-10.41

Small or netless copper shapes (teardrops, artwork), in the pictures only: 91 on Top Layer, 38 on Bottom Layer

## Text on the board
Top Silkscreen Layer: By OOPS
